# Altium schematic sheet Top_level.SchDoc
size C; SheetNumber: 1; SheetTotal: 5
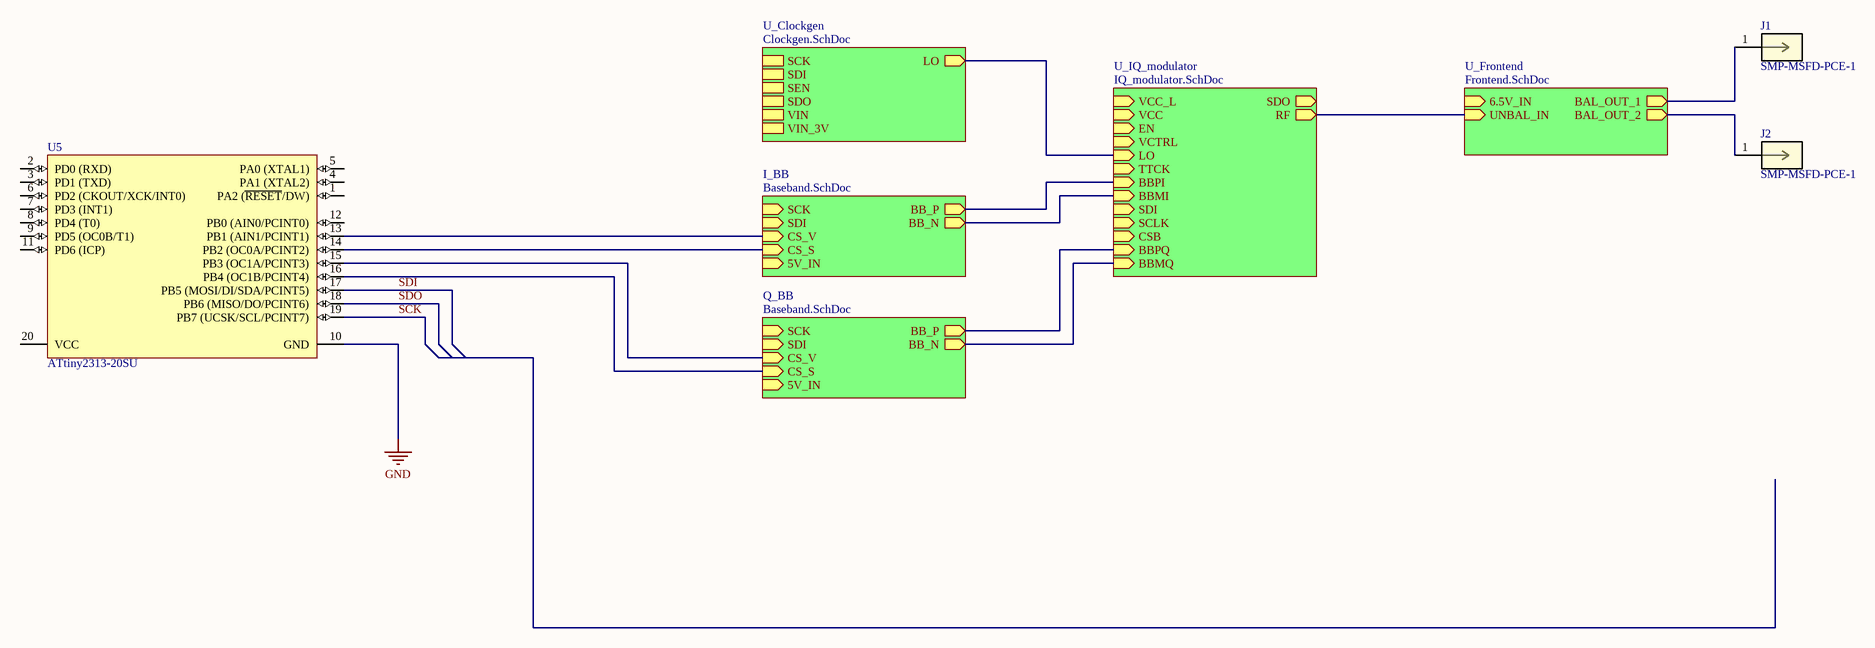
[diagram p0: Top_level.SchDoc]

## Parts
J1  SMP-MSFD-PCE-1  [CONN_SMP-MSFD-PCE-1_AMP]
J2  SMP-MSFD-PCE-1  [CONN_SMP-MSFD-PCE-1_AMP]
U5  ATtiny2313-20SU  [20S_L]

## Sub-sheets
I_BB = Baseband.SchDoc: SCK (in), SDI (in), CS_V (in), CS_S (in), 5V_IN (in), BB_P (out), BB_N (out)
Q_BB = Baseband.SchDoc: SCK (in), SDI (in), CS_V (in), CS_S (in), 5V_IN (in), BB_P (out), BB_N (out)
U_Clockgen = Clockgen.SchDoc: LO (out), SCK, SDI, SEN, SDO, VIN, VIN_3V
U_Frontend = Frontend.SchDoc: 6.5V_IN (in), BAL_OUT_1 (out), BAL_OUT_2 (out), UNBAL_IN (in)
U_IQ_modulator = IQ_modulator.SchDoc: VCC_L (in), VCC (in), EN (in), VCTRL (in), LO (in), TTCK (in), BBPI (in), BBMI (in), SDO (out), SDI (in), SCLK (in), CSB (in), RF (out), BBMQ (in), BBPQ (in)

## Nets
GND: U5.10(GND)
SCK: U5.19(PB7_(UCSK/SCL/PCINT7))
SDI: U5.17(PB5_(MOSI/DI/SDA/PCINT5))
SDO: U5.18(PB6_(MISO/DO/PCINT6))
NetJ1_1: J1.1 ; sheet U_Frontend/BAL_OUT_1
NetJ2_1: J2.1 ; sheet U_Frontend/BAL_OUT_2
NetU5_13: U5.13(PB1_(AIN1/PCINT1)) ; sheet I_BB/CS_V
NetU5_14: U5.14(PB2_(OC0A/PCINT2)) ; sheet I_BB/CS_S
NetU5_15: U5.15(PB3_(OC1A/PCINT3)) ; sheet Q_BB/CS_V
NetU5_16: U5.16(PB4_(OC1B/PCINT4)) ; sheet Q_BB/CS_S
(unnamed): sheet U_Frontend/UNBAL_IN, sheet U_IQ_modulator/RF
(unnamed): sheet I_BB/BB_P, sheet U_IQ_modulator/BBPI
(unnamed): sheet I_BB/BB_N, sheet U_IQ_modulator/BBMI
(unnamed): sheet Q_BB/BB_P, sheet U_IQ_modulator/BBPQ
(unnamed): sheet Q_BB/BB_N, sheet U_IQ_modulator/BBMQ
(unnamed): sheet U_Clockgen/LO, sheet U_IQ_modulator/LO

Not connected (* = marked no-connect by the designer): U5 1(PA2_(~{RESET}/DW)) 2(PD0_(RXD)) 3(PD1_(TXD)) 4(PA1_(XTAL2)) 5(PA0_(XTAL1)) 6(PD2_(CKOUT/XCK/INT0)) 7(PD3_(INT1)) 8(PD4_(T0)) 9(PD5_(OC0B/T1)) 11(PD6_(ICP)) 12(PB0_(AIN0/PCINT0)) 20(VCC)

## Library data of the parts
J1 J2 = SMP-MSFD-PCE-1: No Description Available; Mfr_Name: Amphenol ICC; Copyright: Copyright (C) 2023 Ultra Librarian. All rights reserved.; Manufacturer_Part_Number: SMP-MSFD-PCE-1; RefDes: RefDes; Type: DEV
U5 = CMP-0093-00143-2: Low Power tinyAVR® 8-Bit Microcontroller, 2.7-5.5V, 20MHz, 2K Flash Memory, Industrial Grade (-40°C to 85°C), 20-Lead SOIC, Pb-Free; DatasheetVersion: revL, Aug-2010; ComponentLink1Description: Manufacturer URL; ComponentLink3Description: ATtiny2313 Summary; Code_JEDEC: MS-013-AC; PackageDescription: 20-lead, 0.300" Wide Body, Plastic Gull Wing Small Outline Package (SOIC); RevisionNote: DatasheetVersion & PackageVersion updated. URLs added.; ComponentLink2URL: http://www.atmel.com/dyn/resources/prod_documents/doc2543.pdf; ComponentLink3URL: http://www.atmel.com/dyn/resources/prod_documents/doc2543S.pdf; Code_IPC: SOIC127P1030-20; ComponentLink2Description: ATtiny2313 Datasheet; PackageReference: 20S; ComponentLink1URL: http://www.atmel.com/; PackageVersion: revB, Nov-2006